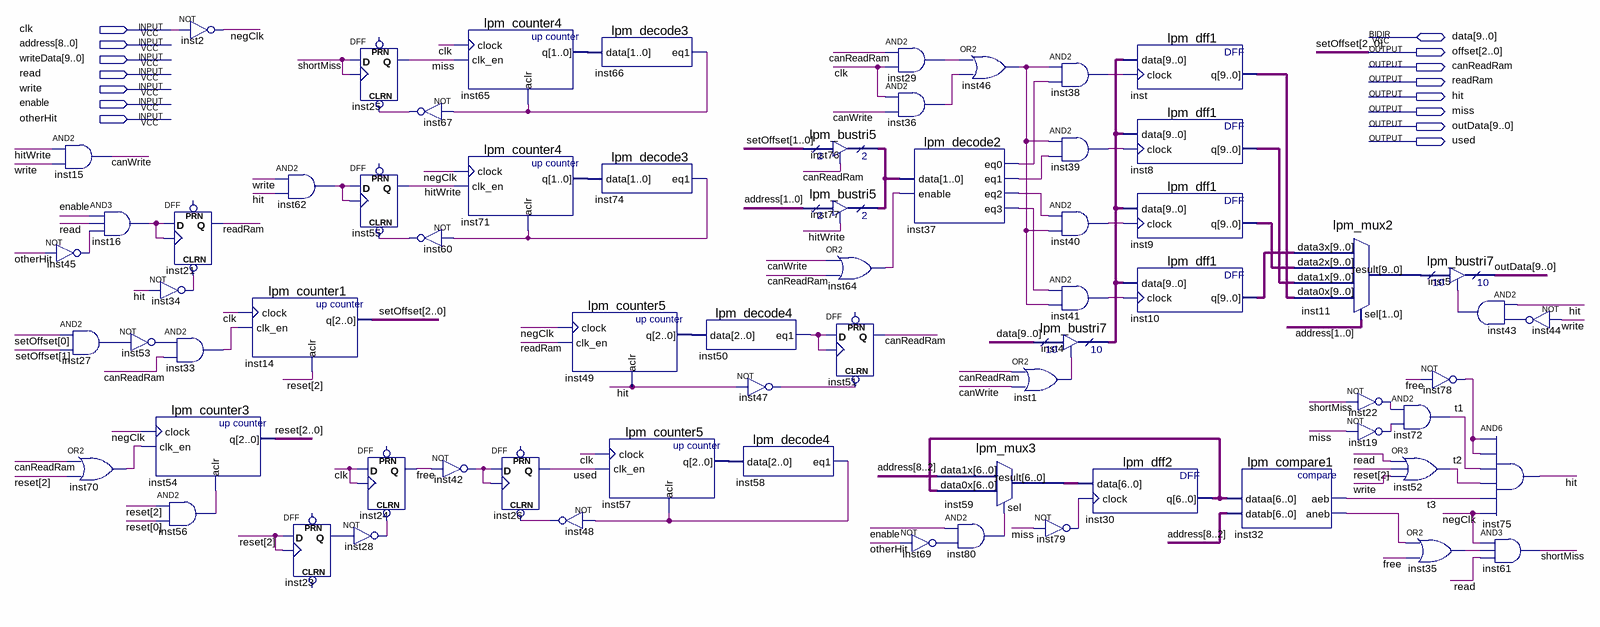
[diagram p0: schematic sheet]
// Quartus schematic String.bdf as structural Verilog: 69 symbols, 15 pins
module String (
  input  clk,
  input  [8:0] address,
  input  [9:0] writeData,
  input  read,
  input  write,
  input  enable,
  input  otherHit,
  inout  [9:0] data,
  output [2:0] offset,
  output canReadRam,
  output readRam,
  output hit,
  output miss,
  output [9:0] outData,
  output used
);

  wire canWrite, free, hitWrite, inst1_out, inst16_out, inst19_out, inst22_out, inst23_q, inst27_out,
       inst28_out, inst29_out, inst32_aneb, inst33_out, inst34_out, inst35_out, inst36_out, inst37_eq0,
       inst37_eq1, inst37_eq2, inst37_eq3, inst38_out, inst39_out, inst40_out, inst41_out, inst42_out,
       inst43_out, inst44_out, inst45_out, inst46_out, inst47_out, inst48_out, inst50_eq1, inst53_out,
       inst56_out, inst58_eq1, inst60_out, inst62_out, inst64_out, inst66_eq1, inst67_out, inst69_out,
       inst70_out, inst74_eq1, inst78_out, inst79_out, inst80_out, negClk, shortMiss, t1, t2, t3;
  wire [1:0] inst65_q, inst71_q, inst76_tridata;
  wire [2:0] inst49_q, inst57_q, reset;
  wire [6:0] inst30_q, inst59_result;
  wire [9:0] inst4_tridata, inst8_q, inst9_q, inst10_q, inst11_result, inst_q;

  not inst45 (inst45_out, otherHit);
  and inst15 (canWrite, hitWrite, write);
  and inst16 (inst16_out, enable, read, inst45_out);
  and inst27 (inst27_out, offset[0], offset[1]);
  or inst70 (inst70_out, canReadRam, reset[2]);
  DFF inst21 (.CLRN(inst34_out), .CLK(inst16_out), .D(inst16_out), .Q(readRam));  // open: PRN
  not inst34 (inst34_out, hit);
  and inst33 (inst33_out, inst53_out, canReadRam);
  not inst53 (inst53_out, inst27_out);
  lpm_counter3 inst54 (.clock(negClk), .clk_en(inst70_out), .aclr(inst56_out), .q(reset));
  and inst56 (inst56_out, reset[2], reset[0]);
  not inst2 (negClk, clk);
  and inst62 (inst62_out, write, hit);
  lpm_counter1 inst14 (.clock(clk), .clk_en(inst33_out), .aclr(reset[2]), .q(offset));
  DFF inst23 (.CLK(reset[2]), .D(reset[2]), .Q(inst23_q));  // open: CLRN, PRN
  not inst28 (inst28_out, inst23_q);
  DFF inst25 (.CLRN(inst67_out), .CLK(shortMiss), .D(shortMiss), .Q(miss));  // open: PRN
  DFF inst55 (.CLRN(inst60_out), .CLK(inst62_out), .D(inst62_out), .Q(hitWrite));  // open: PRN
  DFF inst24 (.CLRN(inst28_out), .CLK(clk), .D(clk), .Q(free));  // open: PRN
  lpm_counter4 inst65 (.clock(clk), .clk_en(miss), .aclr(inst66_eq1), .q(inst65_q));
  not inst67 (inst67_out, inst66_eq1);
  lpm_counter4 inst71 (.clock(negClk), .clk_en(hitWrite), .aclr(inst74_eq1), .q(inst71_q));
  not inst60 (inst60_out, inst74_eq1);
  not inst42 (inst42_out, free);
  DFF inst26 (.CLRN(inst48_out), .CLK(inst42_out), .D(inst42_out), .Q(used));  // open: PRN
  lpm_counter5 inst49 (.clock(negClk), .clk_en(readRam), .aclr(hit), .q(inst49_q));
  not inst48 (inst48_out, inst58_eq1);
  lpm_decode3 inst66 (.data(inst65_q), .eq1(inst66_eq1));
  lpm_decode3 inst74 (.data(inst71_q), .eq1(inst74_eq1));
  lpm_counter5 inst57 (.clock(clk), .clk_en(used), .aclr(inst58_eq1), .q(inst57_q));
  lpm_decode4 inst50 (.data(inst49_q), .eq1(inst50_eq1));
  not inst47 (inst47_out, hit);
  lpm_decode4 inst58 (.data(inst57_q), .eq1(inst58_eq1));
  lpm_bustri5 inst76 (.enabledt(canReadRam), .data(offset[1:0]), .tridata(inst76_tridata));
  lpm_bustri5 inst77 (.enabledt(hitWrite), .data(address[1:0]), .tridata(inst76_tridata));
  or inst64 (inst64_out, canWrite, canReadRam);
  DFF inst51 (.CLRN(inst47_out), .CLK(inst50_eq1), .D(inst50_eq1), .Q(canReadRam));  // open: PRN
  and inst29 (inst29_out, canReadRam, clk);
  and inst36 (inst36_out, clk, canWrite);
  lpm_decode2 inst37 (
    .data(inst76_tridata), .enable(inst64_out), .eq0(inst37_eq0), .eq1(inst37_eq1), .eq2(inst37_eq2),
    .eq3(inst37_eq3));
  lpm_mux3 inst59 (.data1x(address[8:2]), .data0x(inst30_q), .sel(inst80_out), .result(inst59_result));
  not inst69 (inst69_out, otherHit);
  or inst46 (inst46_out, inst29_out, inst36_out);
  and inst80 (inst80_out, enable, inst69_out);
  and inst38 (inst38_out, inst46_out, inst37_eq0);
  and inst39 (inst39_out, inst46_out, inst37_eq1);
  and inst40 (inst40_out, inst37_eq2, inst46_out);
  and inst41 (inst41_out, inst37_eq3, inst46_out);
  lpm_bustri7 inst4 (.enabledt(inst1_out), .data(data), .tridata(inst4_tridata));
  or inst1 (inst1_out, canReadRam, canWrite);
  not inst79 (inst79_out, miss);
  lpm_dff2 inst30 (.data(inst59_result), .clock(inst79_out), .q(inst30_q));
  lpm_dff1 inst (.data(inst4_tridata), .clock(inst38_out), .q(inst_q));
  lpm_dff1 inst8 (.data(inst4_tridata), .clock(inst39_out), .q(inst8_q));
  lpm_dff1 inst9 (.data(inst4_tridata), .clock(inst40_out), .q(inst9_q));
  lpm_dff1 inst10 (.data(inst4_tridata), .clock(inst41_out), .q(inst10_q));
  lpm_compare1 inst32 (.dataa(inst30_q), .datab(address[8:2]), .aeb(t3), .aneb(inst32_aneb));
  lpm_mux2 inst11 (
    .data3x(inst10_q), .data2x(inst9_q), .data1x(inst8_q), .data0x(inst_q), .sel(address[1:0]),
    .result(inst11_result));
  not inst22 (inst22_out, shortMiss);
  not inst19 (inst19_out, miss);
  and inst72 (t1, inst22_out, inst19_out);
  or inst52 (t2, read, reset[2], write);
  or inst35 (inst35_out, inst32_aneb, free);
  lpm_bustri7 inst5 (.enabledt(inst43_out), .data(inst11_result), .tridata(outData));
  and inst43 (inst43_out, hit, inst44_out);
  not inst78 (inst78_out, free);
  not inst44 (inst44_out, write);
  and inst75 (hit, inst78_out, inst78_out, t1, t2, t3, negClk);
  and inst61 (shortMiss, negClk, inst35_out, read);

  // Other names for the same wires on the sheet: setOffset[2:0] = offset
endmodule
